# Altium schematic sheet MotherBoard.SchDoc
size A2
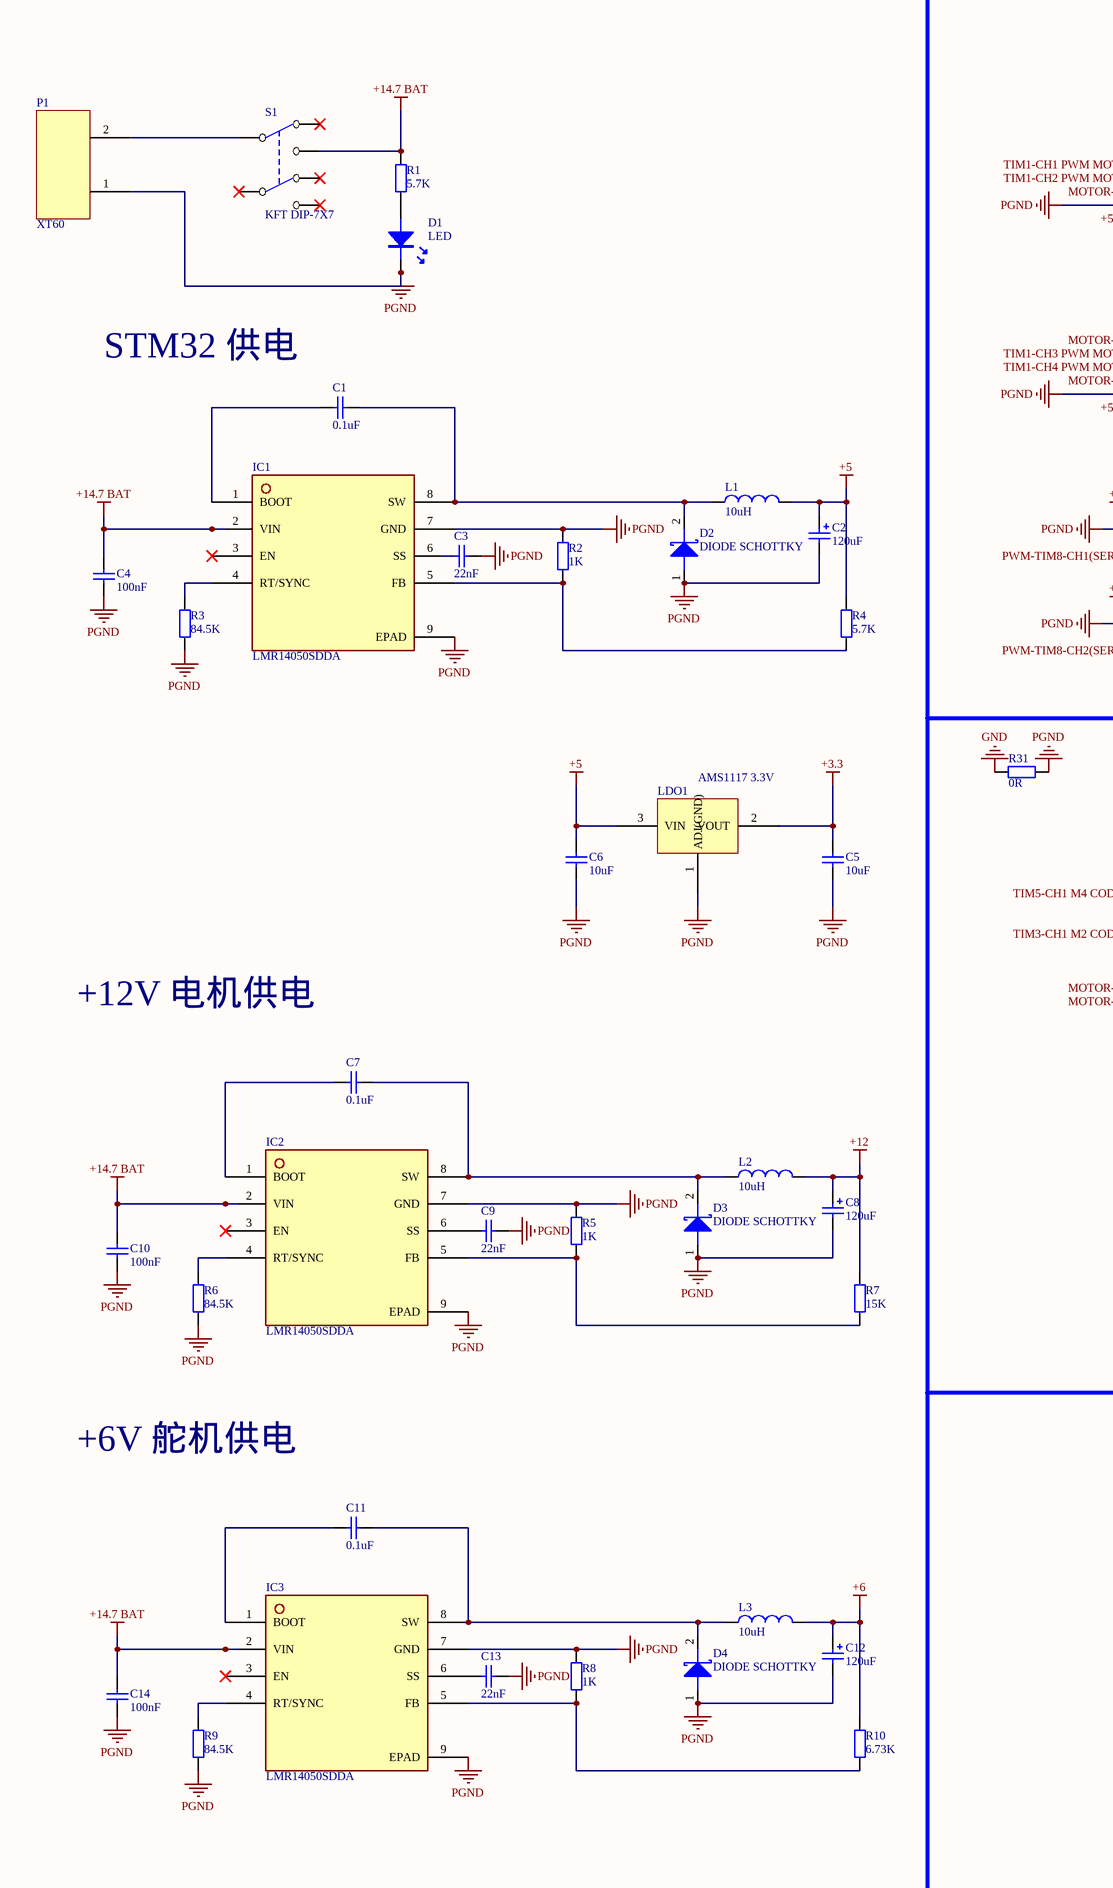
[diagram p0: MotherBoard.SchDoc, left]
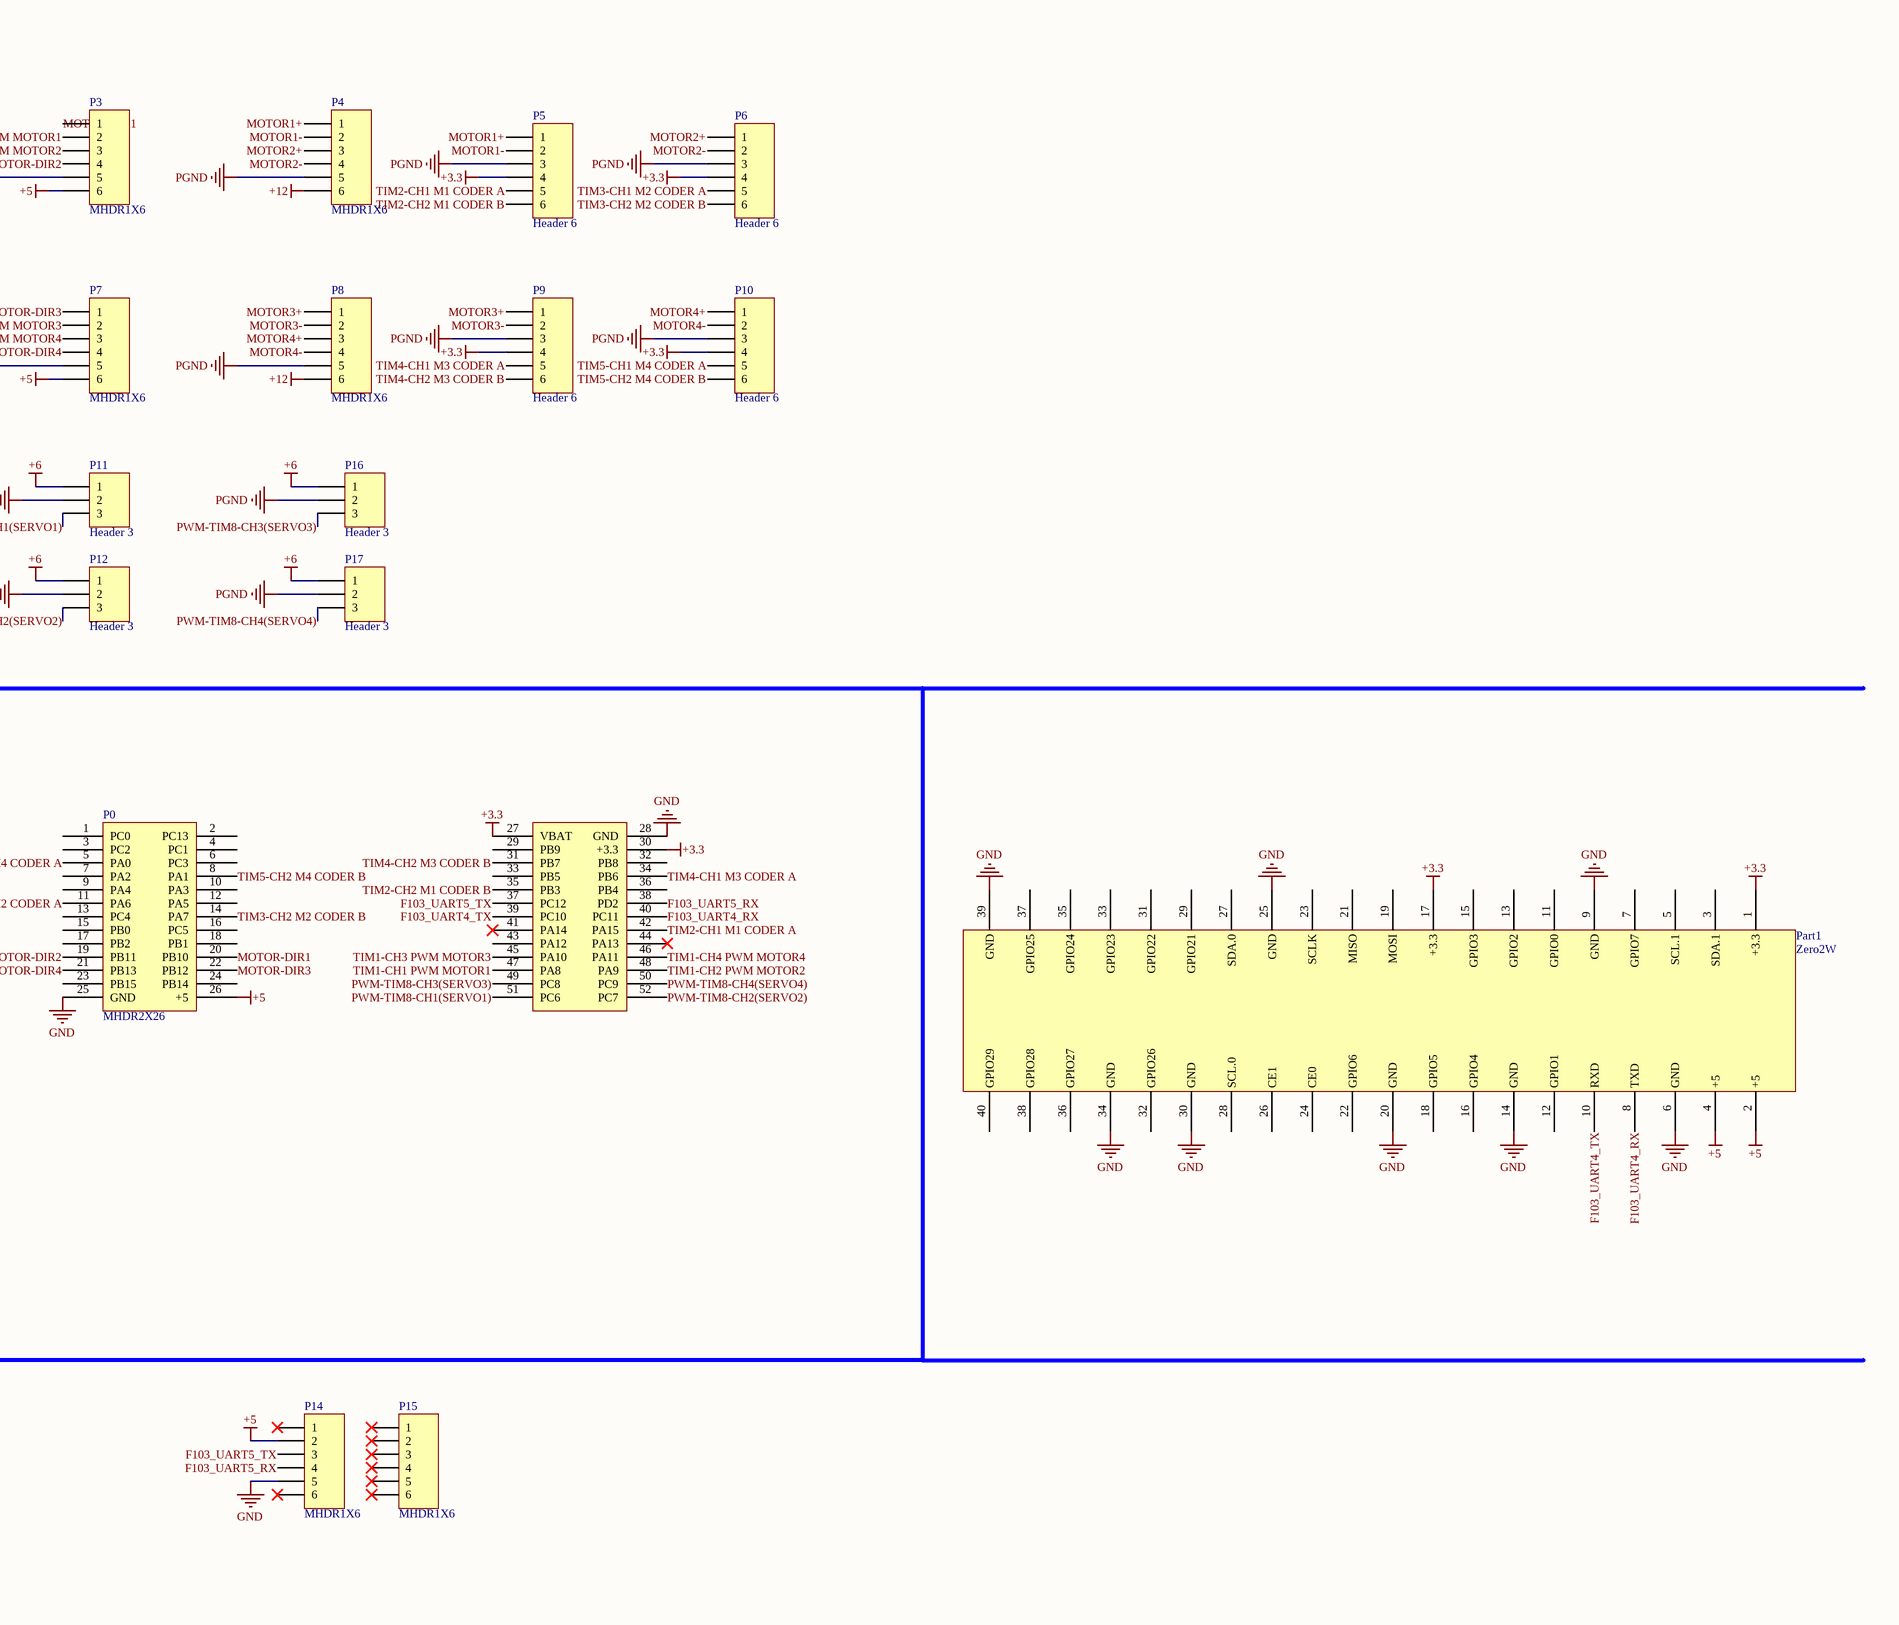
[diagram p1: MotherBoard.SchDoc, right]

## Parts
C1  0.1uF  [CAPC2012X10M]
C2  120uF  [CAP 6.3x15]
C3  22nF  [CAPC2012X10M]
C4  100nF  [CAPC2012X10M]
C5  10uF  [CAPC2012X10M]
C6  10uF  [CAPC2012X10M]
C7  0.1uF  [CAPC2012X10M]
C8  120uF  [CAP 6.3x15]
C9  22nF  [CAPC2012X10M]
C10  100nF  [CAPC2012X10M]
C11  0.1uF  [CAPC2012X10M]
C12  120uF  [CAP 6.3x15]
C13  22nF  [CAPC2012X10M]
C14  100nF  [CAPC2012X10M]
D1  LED  [LED-0805]
D2  DIODE SCHOTTKY  [SMA]
D3  DIODE SCHOTTKY  [SMA]
D4  DIODE SCHOTTKY  [SMA]
IC1  LMR14050SDDA  [SOP127P600X170_HS-9M]
IC2  LMR14050SDDA  [SOP127P600X170_HS-9M]
IC3  LMR14050SDDA  [SOP127P600X170_HS-9M]
L1  10uH  [INDP4442X20M]
L2  10uH  [INDP4442X20M]
L3  10uH  [INDP4442X20M]
LDO1  AMS1117 3.3V  [SOT230P700X180-4M]
P0  MHDR2X26  [PCBComponent_1]
P1  XT60  [XT60H-F]
P3  MHDR1X6  [MPIN-6-2.54-1.0]
P4  MHDR1X6  [MPIN-6-2.54-1.0]
P5  Header 6  [HDR1X6]
P6  Header 6  [HDR1X6]
P7  MHDR1X6  [MPIN-6-2.54-1.0]
P8  MHDR1X6  [MPIN-6-2.54-1.0]
P9  Header 6  [HDR1X6]
P10  Header 6  [HDR1X6]
P11  Header 3  [HDR1X3]
P12  Header 3  [HDR1X3]
P14  MHDR1X6  [MPIN-6-2.54-1.0]
P15  MHDR1X6  [MPIN-6-2.54-1.0]
P16  Header 3  [HDR1X3]
P17  Header 3  [HDR1X3]
Part1  Zero2W  [Zero2W]
R1  5.7K  [0805]
R2  1K  [0805]
R3  84.5K  [0805]
R4  5.7K  [0805]
R5  1K  [0805]
R6  84.5K  [0805]
R7  15K  [0805]
R8  1K  [0805]
R9  84.5K  [0805]
R10  6.73K  [0805]
R31  0R  [0805]
S1  KFT DIP-7X7  [7X7 DIP]

## Nets
+3.3: C5.2 LDO1.2(VOUT) P0.27(VBAT) P0.30(+3.3) P5.4 P6.4 P9.4 P10.4 Part1.1(+3.3) Part1.17(+3.3)
+5: C2.1 C6.2 L1.2 LDO1.3(VIN) P0.26(+5) P3.6 P7.6 P14.2 Part1.2(+5) Part1.4(+5) R4.2
+6: C12.1 L3.2 P11.1 P12.1 P16.1 P17.1 R10.2
+12: C8.1 L2.2 P4.6 P8.6 R7.2
+14.7 BAT: C4.2 C10.2 C14.2 IC1.2(VIN) IC2.2(VIN) IC3.2(VIN) R1.2 S1.1
GND: P0.25(GND) P0.28(GND) P14.5 Part1.6(GND) Part1.9(GND) Part1.14(GND) Part1.20(GND) Part1.25(GND) Part1.30(GND) Part1.34(GND) Part1.39(GND) R31.2
PGND: C2.2 C3.2 C4.1 C5.1 C6.1 C8.2 C9.2 C10.1 C12.2 C13.2 C14.1 D1.2 D2.1 D3.1 D4.1 IC1.7(GND) IC1.9(EPAD) IC2.7(GND) IC2.9(EPAD) IC3.7(GND) IC3.9(EPAD) LDO1.1(ADJ(GND)) P1.1 P3.5 P4.5 P5.3 P6.3 P7.5 P8.5 P9.3 P10.3 P11.2 P12.2 P16.2 P17.2 R2.2 R3.1 R5.2 R6.1 R8.2 R9.1 R31.1
F103_UART4_RX: P0.40(PC11) Part1.8(TXD)
F103_UART4_TX: P0.39(PC10) Part1.10(RXD)
F103_UART5_RX: P0.38(PD2) P14.4
F103_UART5_TX: P0.37(PC12) P14.3
MOTOR1+: P4.1 P5.1
MOTOR1-: P4.2 P5.2
MOTOR2+: P4.3 P6.1
MOTOR2-: P4.4 P6.2
MOTOR3+: P8.1 P9.1
MOTOR3-: P8.2 P9.2
MOTOR4+: P8.3 P10.1
MOTOR4-: P8.4 P10.2
MOTOR-DIR1: P0.20(PB10) P3.1
MOTOR-DIR2: P0.19(PB11) P3.4
MOTOR-DIR3: P0.22(PB12) P7.1
MOTOR-DIR4: P0.21(PB13) P7.4
PWM-TIM8-CH1(SERVO1): P0.51(PC6) P11.3
PWM-TIM8-CH2(SERVO2): P0.52(PC7) P12.3
PWM-TIM8-CH3(SERVO3): P0.49(PC8) P16.3
PWM-TIM8-CH4(SERVO4): P0.50(PC9) P17.3
TIM1-CH1 PWM MOTOR1: P0.47(PA8) P3.2
TIM1-CH2 PWM MOTOR2: P0.48(PA9) P3.3
TIM1-CH3 PWM MOTOR3: P0.45(PA10) P7.2
TIM1-CH4 PWM MOTOR4: P0.46(PA11) P7.3
TIM2-CH1 M1 CODER A: P0.42(PA15) P5.5
TIM2-CH2 M1 CODER B: P0.35(PB3) P5.6
TIM3-CH1 M2 CODER A: P0.11(PA6) P6.5
TIM3-CH2 M2 CODER B: P0.14(PA7) P6.6
TIM4-CH1 M3 CODER A: P0.34(PB6) P9.5
TIM4-CH2 M3 CODER B: P0.31(PB7) P9.6
TIM5-CH1 M4 CODER A: P0.5(PA0) P10.5
TIM5-CH2 M4 CODER B: P0.8(PA1) P10.6
NetC1_1: C1.1 IC1.1(BOOT)
NetC1_2: C1.2 D2.2 IC1.8(SW) L1.1
NetC3_1: C3.1 IC1.6(SS)
NetC7_1: C7.1 IC2.1(BOOT)
NetC7_2: C7.2 D3.2 IC2.8(SW) L2.1
NetC9_1: C9.1 IC2.6(SS)
NetC11_1: C11.1 IC3.1(BOOT)
NetC11_2: C11.2 D4.2 IC3.8(SW) L3.1
NetC13_1: C13.1 IC3.6(SS)
NetD1_1: D1.1 R1.1
NetIC1_4: IC1.4(RT/SYNC) R3.2
NetIC1_5: IC1.5(FB) R2.1 R4.1
NetIC2_4: IC2.4(RT/SYNC) R6.2
NetIC2_5: IC2.5(FB) R5.1 R7.1
NetIC3_4: IC3.4(RT/SYNC) R9.2
NetIC3_5: IC3.5(FB) R8.1 R10.1
NetP1_2: P1.2 S1.2

Not connected (* = marked no-connect by the designer): IC1 3(EN)*; IC2 3(EN)*; IC3 3(EN)*; P0 1(PC0) 2(PC13) 3(PC2) 4(PC1) 6(PC3) 7(PA2) 9(PA4) 10(PA3) 12(PA5) 13(PC4) 15(PB0) 16(PC5) 17(PB2) 18(PB1) 23(PB15) 24(PB14) 29(PB9) 32(PB8) 33(PB5) 36(PB4) 41(PA14)* 43(PA12) 44(PA13)*; P14 1* 6*; P15 1* 2* 3* 4* 5* 6*; Part1 3(SDA.1) 5(SCL.1) 7(GPIO7) 11(GPIO0) 12(GPIO1) 13(GPIO2) 15(GPIO3) 16(GPIO4) 18(GPIO5) 19(MOSI) 21(MISO) 22(GPIO6) 23(SCLK) 24(CE0) 26(CE1) 27(SDA.0) 28(SCL.0) 29(GPIO21) 31(GPIO22) 32(GPIO26) 33(GPIO23) 35(GPIO24) 36(GPIO27) 37(GPIO25) 38(GPIO28) 40(GPIO29); S1 3* 4* 5* 6*

## Notes on the sheet
- STM32 供电
- +12V 电机供电
- +6V 舵机供电

## Library data of the parts
C1 = Cap: Capacitor 0.1uF; Published: 8-Jun-2000; LatestRevisionDate: 17-Jul-2002; LatestRevisionNote: Re-released for DXP Platform.; PackageReference: RAD-0.3; Publisher: Altium Limited; PackageDescription: Radial Cap, Thru-Hole; 2 Leads; 0.3 in Pin Spacing
C2 C8 C12 = Cap Pol: Polarized Capacitor (Radial); Published: 8-Jun-2000; LatestRevisionDate: 17-Jul-2002; LatestRevisionNote: Re-released for DXP Platform.; PackageReference: RB7.6-15; Publisher: Altium Limited; PackageDescription: Polarized Capacitor (Radial); 2 Leads
C3-C7 C9-C11 C13 C14 = Cap: Capacitor; Published: 8-Jun-2000; LatestRevisionDate: 17-Jul-2002; LatestRevisionNote: Re-released for DXP Platform.; PackageReference: RAD-0.3; Publisher: Altium Limited; PackageDescription: Radial Cap, Thru-Hole; 2 Leads; 0.3 in Pin Spacing
D2-D4 = DIODE SCHOTTKY: 肖特基二极管
L1-L3 = Inductor: Code_IEC: 1005; Published: 8-Jun-2000; LatestRevisionDate: 29-May-2009; LatestRevisionNote: IPC-7351 Footprint Added.; PackageReference: 0402-A; Publisher: Altium Limited; PackageDescription: Chip Inductor; Code_JEITA: 0402
P0 = MHDR2X26: Header, 52-Pin, Dual row; LatestRevisionDate: 17-Jul-2002; LatestRevisionNote: Re-released for DXP Platform.; Publisher: Altium Limited
P3 P4 P7 P8 P14 P15 = MHDR1X6: Header, 6-Pin; LatestRevisionDate: 17-Jul-2002; LatestRevisionNote: Re-released for DXP Platform.; Publisher: Altium Limited
P5 P6 P9 P10 = Header 6: Header, 6-Pin; LatestRevisionDate: 17-Jul-2002; LatestRevisionNote: Re-released for DXP Platform.; Publisher: Altium Limited
P11 P12 P16 P17 = Header 3: Header, 3-Pin; LatestRevisionDate: 17-Jul-2002; LatestRevisionNote: Re-released for DXP Platform.; Publisher: Altium Limited
R1-R10 R31 = Res: Resistor; Published: 8-Jun-2000; LatestRevisionDate: 17-Jul-2002; LatestRevisionNote: Re-released for DXP Platform.; PackageReference: AXIAL-0.4; Publisher: Altium Limited; PackageDescription: Axial Device, Thru-Hole; 2 Leads; 0.4 in Pin Spacing